# EAGLE design imu (EAGLE 7.5.0)
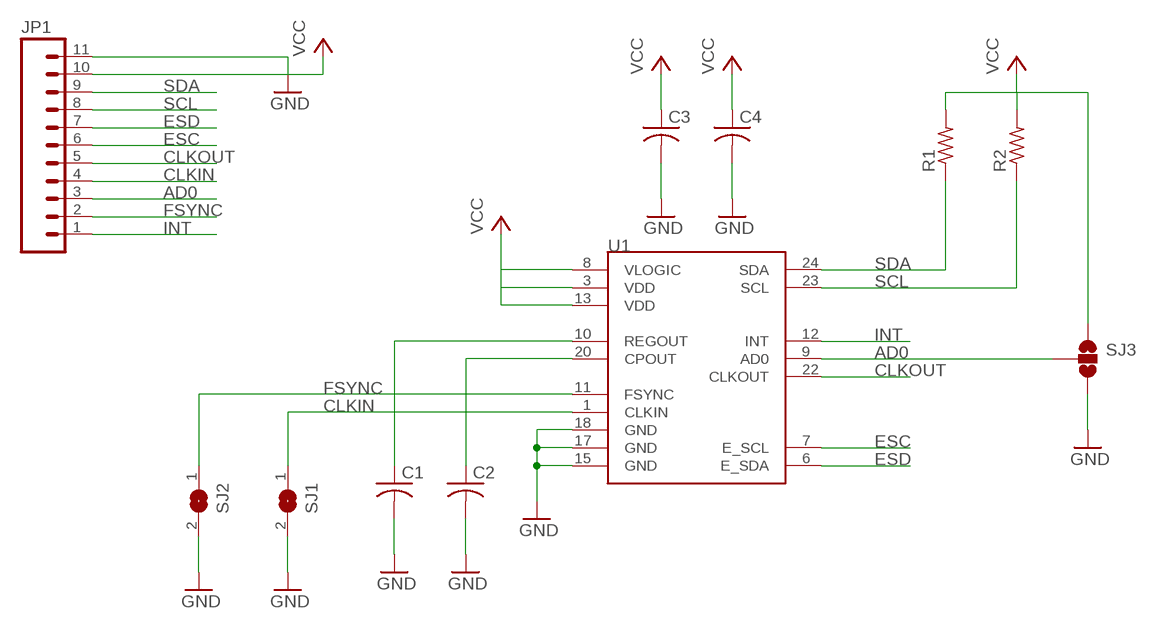
[diagram p0: schematic, sheet 1]

## Parts
C1  C-USC0805  [C0805]
C2  C-USC0805  [C0805]
C3  C-USC0805  [C0805]
C4  C-USC0805  [C0805]
JP1  M11PTH  [1X11]
R1  R-US_R0805  [R0805]
R2  R-US_R0805  [R0805]
SJ1  SJ  [SJ]
SJ2  SJ  [SJ]
SJ3  SOLDERJUMPER_2WAY-OLDW  [SJ_2W]
U1  MPU-9150QFN-24-NP  [QFN-24-NP]

## Nets
AD0: JP1.3 SJ3.2 U1.9(AD0)
CLKIN: JP1.4 SJ1.1 U1.1(CLKIN)
CLKOUT: JP1.5 U1.22(CLKOUT)
ESC: JP1.6 U1.7(E_SCL)
ESD: JP1.7 U1.6(E_SDA)
FSYNC: JP1.2 SJ2.1 U1.11(FSYNC)
GND: C1.2 C2.2 C3.2 C4.2 JP1.11 SJ1.2 SJ2.2 SJ3.3 U1.15(GND) U1.17(GND) U1.18(GND)
INT: JP1.1 U1.12(INT)
N$3: C1.1 U1.10(REGOUT)
N$4: C2.1 U1.20(CPOUT)
SCL: JP1.8 R2.1 U1.23(SCL)
SDA: JP1.9 R1.1 U1.24(SDA)
VCC: C3.1 C4.1 JP1.10 R1.2 R2.2 SJ3.1 U1.3(VDD) U1.8(VLOGIC) U1.13(VDD)

## Library data of the parts
C1-C4 = rcl:C-US: CAPACITOR, American symbol
JP1 = SparkFun-Connectors:M11: Header 11 Standard 11-pin 0.1" header. Use with straight break away headers (SKU : PRT-00116), right angle break away headers (PRT-00553), swiss pins (PRT-00743), machine pins (PRT-00117), and female headers (PRT-00115).
R1 R2 = rcl:R-US_: RESISTOR, American symbol
SJ1 SJ2 = jumper:SJ: SMD solder JUMPER
SJ3 = SparkFun-Retired:SOLDERJUMPER_2WAY-OLD: Solder Jumper 2 way solder jumper
U1 = SparkFun-Sensors:MPU-9150: 9DOF (3mag, 3accel, 3rotat). I2C interface.

## Board
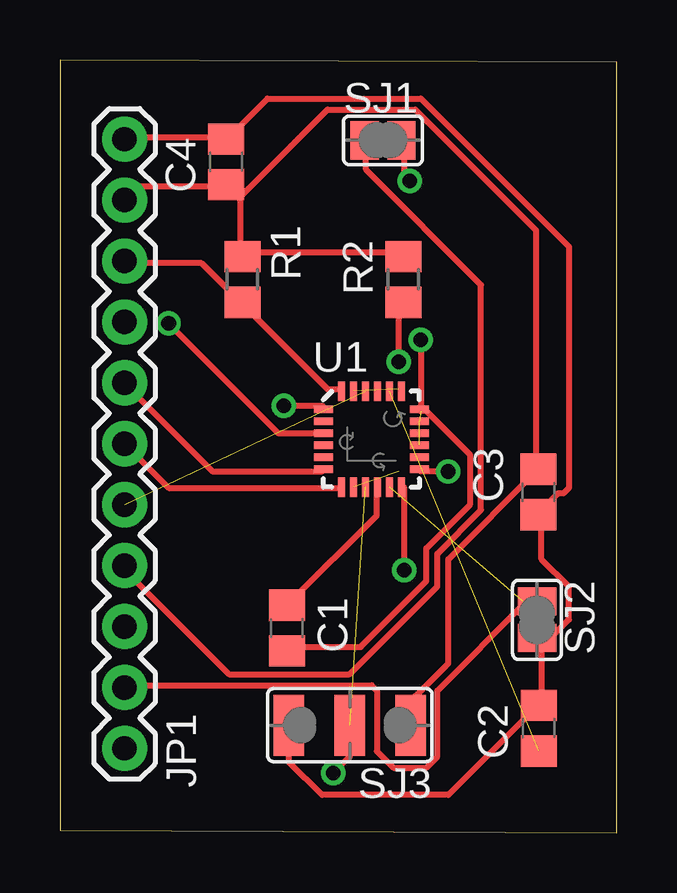
[diagram p1: board, top side]
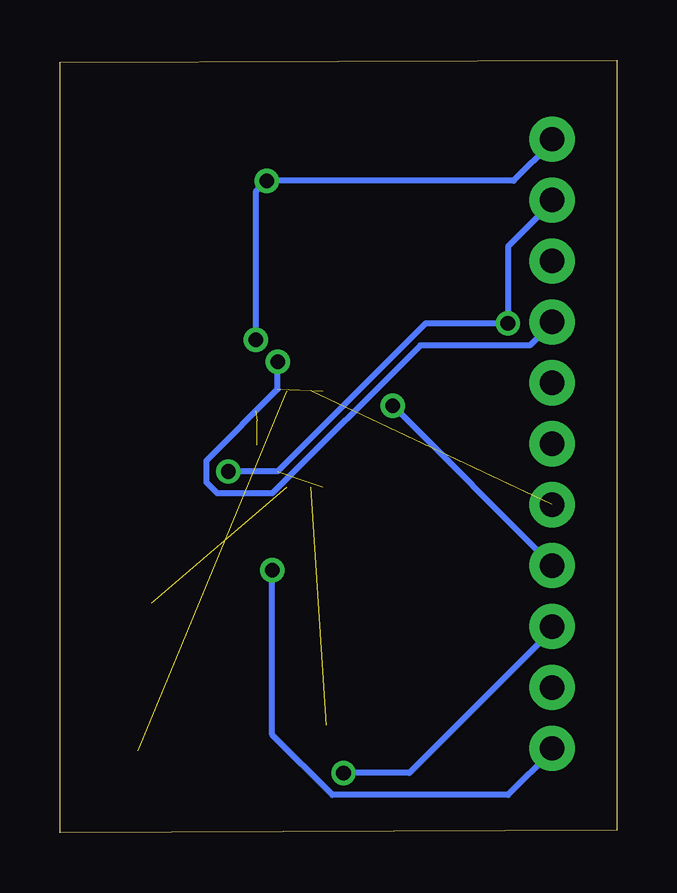
[diagram p2: board, bottom side, seen from below]

Size 23.21 x 32.21 mm. Coordinates in mm from the lower left corner, seen from the top.
Outline: 0,0.1 23.21,0 23.21,32.11 0,32.21 0,0.1
Copper layers (1*16): Top 0.035mm / dielectric 1.5mm / Bottom 0.035mm
Design rules "default": minimum track width 10mil, minimum drill 24mil, track to track 8mil, track to pad 8mil, pad to pad 8mil, via to via 8mil, smd to smd 8mil, copper to edge 40mil, drill to drill 8mil, minimum pad ring 10mil, minimum via ring 8mil, stop-mask expansion 4mil, vias tented up to drill 0mil, thermal gap 10mil

### Footprints (pad centres in the part's own frame; a part is rotated, then mirrored left to right if it is on the bottom)
C0805 = smd 1.3 x 1.5: 1 -0.95,0; 2 0.95,0
1X11 = drill 1.016 pad 1.88: 1 0,0; 2 2.54,0; 3 5.08,0; 4 7.62,0; 5 10.16,0; 6 12.7,0; 7 15.24,0; 8 17.78,0; 9 20.32,0; 10 22.86,0; 11 25.4,0
R0805 = smd 1.3 x 1.5: 1 -0.95,0; 2 0.95,0
SJ = smd 1.168 x 1.6: 1 -0.762,0; 2 0.762,0
SJ_2W = smd 1.27 x 2.54: 1 -2.54,0; 2 0,0; 3 2.54,0
QFN-24-NP = smd 0.8 x 0.3: 1 -2,1.25; 2 -2,0.75; 3 -2,0.25; 4 -2,-0.25; 5 -2,-0.75; 6 -2,-1.25; 13 2,-1.25; 14 2,-0.75; 15 2,-0.25; 16 2,0.25; 17 2,0.75; 18 2,1.25 | smd 0.3 x 0.8: 7 -1.25,-2; 8 -0.75,-2; 9 -0.25,-2; 10 0.25,-2; 11 0.75,-2; 12 1.25,-2; 19 1.25,2; 20 0.75,2; 21 0.25,2; 22 -0.25,2; 23 -0.75,2; 24 -1.25,2

### Placement (x,y rotation side)
C1  9.46,8.53 270 top
C2  19.96,4.35 90 top
C3  19.95,14.2 270 top
C4  6.93,27.96 90 top
JP1  2.69,3.51 90 top
R1  7.61,23.06 90 top
R2  14.32,23.06 90 top
SJ1  13.47,28.86 0 top
SJ2  19.89,8.87 270 top
SJ3  12.09,4.48 180 top
U1  12.99,16.4 0 top

### Tracks (layer width: path | path; a pad name or v marks a point on that pad's centre or on a via)
AD0  (via drill 0.61)  (1 unrouted)
  Top 0.254: v11.39,2.48 12.08,3.17 12.08,4.31 SJ3.2
  Bottom 0.254: v11.39,2.48 8.65,2.48 2.7,8.43 JP1.3
CLKIN  (via drill 0.61)
  Top 0.254: v9.33,17.8 10.93,17.8 U1.1 | SJ1.1 12.76,28.77 12.76,27.63 17.56,22.83 17.56,13.45 15.73,11.62 15.73,10.25 12.08,6.6 7.05,6.6 2.7,10.94 JP1.4
  Bottom 0.254: v9.33,17.8 2.7,11.17 JP1.4
CLKOUT  (1 unrouted)
ESC
  Top 0.254: U1.7 11.62,14.37 4.53,14.37 2.7,16.2 JP1.6
ESD
  Top 0.254: U1.6 10.93,15.05 6.36,15.05 2.7,18.71 JP1.7
FSYNC  (1 unrouted)
  Top 0.254: SJ2.1 19.85,9.57 19.39,9.57 15.73,5.91 15.73,3.17 15.28,2.71 13.9,2.71 13.22,3.4 13.22,5.91 12.99,6.14 2.7,6.14 JP1.2
GND  (via drill 0.61)  (2 unrouted)
  Top 0.254: 20.08,7.74 20.08,7.97 SJ2.2 20.08,7.74 | 20.08,7.74 20.08,5.45 C2.2 19.85,5.22 16.19,1.57 10.93,1.57 9.56,2.94 9.56,4.31 SJ3.3 | 20.08,7.74 21.22,8.88 21.22,10.25 20.08,11.4 20.08,13.22 C3.2 20.08,13.45 20.76,14.14 20.99,14.14 21.22,14.37 21.22,24.43 15.05,30.6 8.65,30.6 7.05,29 C4.2 6.82,29 2.7,29 JP1.11 | C1.2 9.56,7.74 12.53,7.74 15.28,10.48 15.28,11.85 17.1,13.68 17.1,15.74 15.28,17.57 15.05,17.57 U1.18 15.05,17.8 v15.05,20.54 | v14.59,27.17 14.36,27.4 14.36,28.77 SJ1.2
  Bottom 0.254: JP1.11 2.7,28.77 4.3,27.17 v14.59,27.17 15.05,26.71 v15.05,20.54
INT  (via drill 0.61)
  Top 0.254: v14.36,10.94 14.36,14.37 U1.12
  Bottom 0.254: v14.36,10.94 14.36,4.08 11.85,1.57 4.53,1.57 2.7,3.4 JP1.1
N$3
  Top 0.254: U1.10 13.22,14.37 13.22,13.22 9.56,9.57 C1.1
N$4  (1 unrouted)
SCL  (via drill 0.61)  (1 unrouted)
  Top 0.254: v14.13,19.63 14.13,21.91 R2.1
  Bottom 0.254: v14.13,19.63 14.13,18.48 17.1,15.51 17.1,14.6 16.65,14.14 14.36,14.14 8.19,20.31 3.62,20.31 2.7,21.23 JP1.8
SDA
  Top 0.254: U1.24 11.62,18.48 11.16,18.48 7.73,21.91 R1.1 7.5,22.14 5.9,23.74 2.7,23.74 JP1.9
VCC  (via drill 0.61)  (1 unrouted)
  Top 0.254: SJ3.1 14.82,4.54 14.82,5.68 16.19,7.05 16.19,11.4 19.85,15.05 C3.1 19.85,15.28 19.85,25.11 14.82,30.14 11.16,30.14 7.5,26.48 | 7.5,26.48 7.5,24.2 R1.2 7.73,24.2 14.13,24.2 R2.2 | 7.5,26.48 7.05,26.94 C4.1 | v4.53,21.23 9.1,16.65 10.93,16.65 U1.3 | v16.19,15.05 15.05,15.05 U1.13 | C4.1 6.82,26.94 3.16,26.94 2.7,26.48 JP1.10 | 7.5,26.48 C4.1
  Bottom 0.254: JP1.10 2.7,26.26 4.53,24.43 v4.53,21.23 7.96,21.23 14.13,15.05 v16.19,15.05

### Text on the board
Top: ELECTROMATICA